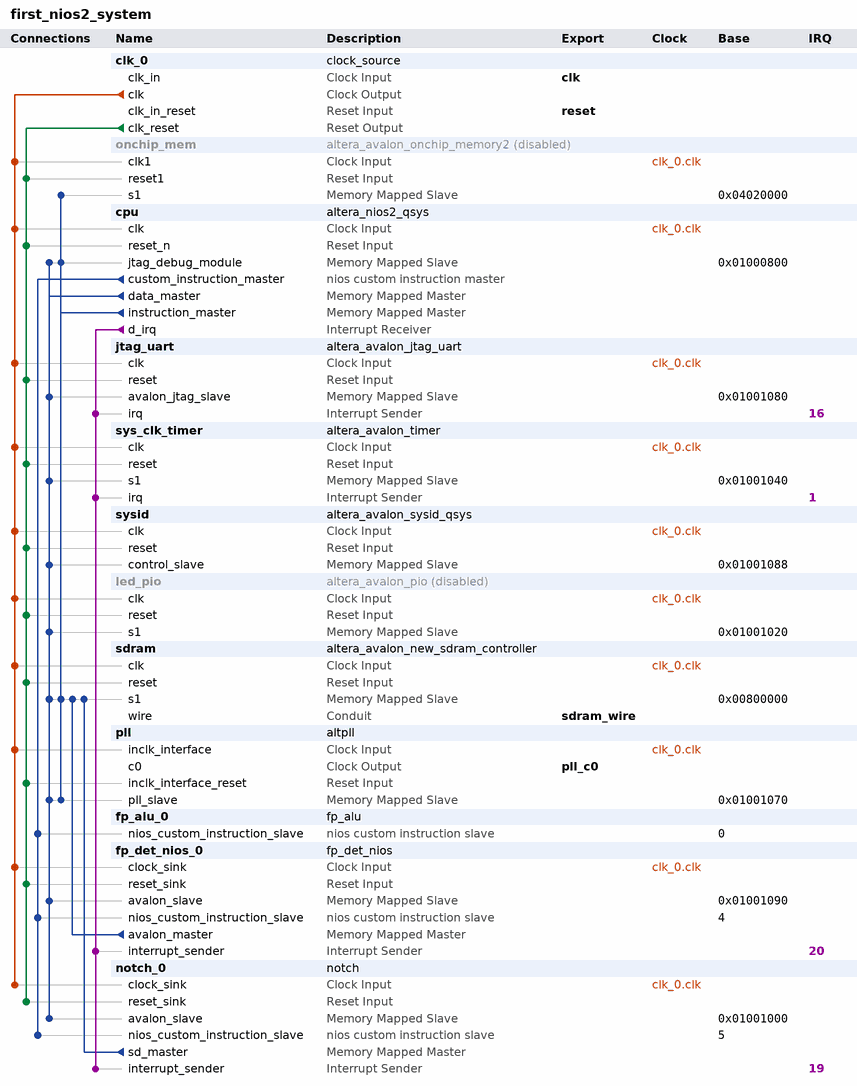
[diagram p0: system contents]
# Platform Designer (Qsys) system first_nios2_system, Cyclone III EP3C120F780C7
# Parameters at their usual value, and those the tool derives, are not listed.
package require -exact qsys 12.0
create_system first_nios2_system
set_project_property DEVICE_FAMILY {Cyclone III}
set_project_property DEVICE EP3C120F780C7

add_instance clk_0 clock_source 12.0
set_instance_parameter_value clk_0 clockFrequency 50000000

add_instance onchip_mem altera_avalon_onchip_memory2 12.0
set_instance_property onchip_mem ENABLED false
set_instance_parameter_value onchip_mem dataWidth 32
set_instance_parameter_value onchip_mem dualPort false
set_instance_parameter_value onchip_mem initMemContent true
set_instance_parameter_value onchip_mem initializationFileName onchip_mem
set_instance_parameter_value onchip_mem memorySize 102400

add_instance cpu altera_nios2_qsys 12.0
set_instance_parameter_value cpu muldiv_divider true
set_instance_parameter_value cpu resetSlave sdram.s1
set_instance_parameter_value cpu exceptionSlave sdram.s1
set_instance_parameter_value cpu breakSlave cpu.jtag_debug_module
set_instance_parameter_value cpu impl Small
set_instance_parameter_value cpu icache_size 2048

add_instance jtag_uart altera_avalon_jtag_uart 12.0
set_instance_parameter_value jtag_uart simInteractiveOptions INTERACTIVE_ASCII_OUTPUT

add_instance sys_clk_timer altera_avalon_timer 12.0
set_instance_parameter_value sys_clk_timer period 1
set_instance_parameter_value sys_clk_timer periodUnits MSEC
set_instance_parameter_value sys_clk_timer timerPreset FULL_FEATURED

add_instance sysid altera_avalon_sysid_qsys 12.0
set_instance_parameter_value sysid id 0

add_instance led_pio altera_avalon_pio 12.0
set_instance_property led_pio ENABLED false
set_instance_parameter_value led_pio direction Output
set_instance_parameter_value led_pio width 8

add_instance sdram altera_avalon_new_sdram_controller 12.0
set_instance_parameter_value sdram TAC 5.5
set_instance_parameter_value sdram TRCD 20.0
set_instance_parameter_value sdram TRP 20.0
set_instance_parameter_value sdram casLatency 3
set_instance_parameter_value sdram columnWidth 8
set_instance_parameter_value sdram dataWidth 16
set_instance_parameter_value sdram generateSimulationModel false
set_instance_parameter_value sdram model custom
set_instance_parameter_value sdram numberOfBanks 4
set_instance_parameter_value sdram numberOfChipSelects 1
set_instance_parameter_value sdram powerUpDelay 100.0
set_instance_parameter_value sdram refreshPeriod 15.625
set_instance_parameter_value sdram rowWidth 12

add_instance pll altpll 12.0
set_instance_parameter_value pll INCLK0_INPUT_FREQUENCY 20000
set_instance_parameter_value pll GATE_LOCK_SIGNAL NO
set_instance_parameter_value pll VALID_LOCK_MULTIPLIER 1
set_instance_parameter_value pll INVALID_LOCK_MULTIPLIER 5
set_instance_parameter_value pll CLK0_MULTIPLY_BY 1
set_instance_parameter_value pll CLK0_DIVIDE_BY 1
set_instance_parameter_value pll CLK0_PHASE_SHIFT -2550
set_instance_parameter_value pll PORT_clk1 PORT_UNUSED
set_instance_parameter_value pll PORT_clk2 PORT_UNUSED
set_instance_parameter_value pll PORT_clk3 PORT_UNUSED
set_instance_parameter_value pll PORT_ARESET PORT_UNUSED
set_instance_parameter_value pll PORT_LOCKED PORT_UNUSED

add_instance fp_alu_0 fp_alu 1.0
set_instance_parameter_value fp_alu_0 NaN 2147483647

add_instance fp_det_nios_0 fp_det_nios 1.0
set_instance_parameter_value fp_det_nios_0 DEFAULT_DIMENSION 10

add_instance notch_0 notch 1.0
set_instance_parameter_value notch_0 N 2
set_instance_parameter_value notch_0 NO_SAMPLES 963144
set_instance_parameter_value notch_0 SAMPLE_SCALING 2147483647
set_instance_parameter_value notch_0 COEFF_SCALING 16383
set_instance_parameter_value notch_0 DIVIDER_LATENCY 16
set_instance_parameter_value notch_0 SDRAM_WORD_SKIP 4

# connections
add_connection clk_0.clk cpu.clk clock
add_connection clk_0.clk fp_det_nios_0.clock_sink clock
add_connection clk_0.clk jtag_uart.clk clock
add_connection clk_0.clk led_pio.clk clock
add_connection clk_0.clk notch_0.clock_sink clock
add_connection clk_0.clk onchip_mem.clk1 clock
add_connection clk_0.clk pll.inclk_interface clock
add_connection clk_0.clk sdram.clk clock
add_connection clk_0.clk sys_clk_timer.clk clock
add_connection clk_0.clk sysid.clk clock
add_connection clk_0.clk_reset cpu.reset_n reset
add_connection clk_0.clk_reset fp_det_nios_0.reset_sink reset
add_connection clk_0.clk_reset jtag_uart.reset reset
add_connection clk_0.clk_reset led_pio.reset reset
add_connection clk_0.clk_reset notch_0.reset_sink reset
add_connection clk_0.clk_reset onchip_mem.reset1 reset
add_connection clk_0.clk_reset pll.inclk_interface_reset reset
add_connection clk_0.clk_reset sdram.reset reset
add_connection clk_0.clk_reset sys_clk_timer.reset reset
add_connection clk_0.clk_reset sysid.reset reset
add_connection cpu.data_master cpu.jtag_debug_module avalon
set_connection_parameter_value cpu.data_master/cpu.jtag_debug_module baseAddress 0x01000800
add_connection cpu.data_master fp_det_nios_0.avalon_slave avalon
set_connection_parameter_value cpu.data_master/fp_det_nios_0.avalon_slave baseAddress 0x01001090
add_connection cpu.data_master jtag_uart.avalon_jtag_slave avalon
set_connection_parameter_value cpu.data_master/jtag_uart.avalon_jtag_slave baseAddress 0x01001080
add_connection cpu.data_master led_pio.s1 avalon
set_connection_parameter_value cpu.data_master/led_pio.s1 baseAddress 0x01001020
add_connection cpu.data_master notch_0.avalon_slave avalon
set_connection_parameter_value cpu.data_master/notch_0.avalon_slave baseAddress 0x01001000
add_connection cpu.data_master pll.pll_slave avalon
set_connection_parameter_value cpu.data_master/pll.pll_slave baseAddress 0x01001070
add_connection cpu.data_master sdram.s1 avalon
set_connection_parameter_value cpu.data_master/sdram.s1 baseAddress 0x00800000
add_connection cpu.data_master sys_clk_timer.s1 avalon
set_connection_parameter_value cpu.data_master/sys_clk_timer.s1 baseAddress 0x01001040
add_connection cpu.data_master sysid.control_slave avalon
set_connection_parameter_value cpu.data_master/sysid.control_slave baseAddress 0x01001088
add_connection cpu.instruction_master cpu.jtag_debug_module avalon
set_connection_parameter_value cpu.instruction_master/cpu.jtag_debug_module baseAddress 0x01000800
add_connection cpu.instruction_master onchip_mem.s1 avalon
set_connection_parameter_value cpu.instruction_master/onchip_mem.s1 baseAddress 0x04020000
add_connection cpu.instruction_master pll.pll_slave avalon
set_connection_parameter_value cpu.instruction_master/pll.pll_slave baseAddress 0x01001070
add_connection cpu.instruction_master sdram.s1 avalon
set_connection_parameter_value cpu.instruction_master/sdram.s1 baseAddress 0x00800000
add_connection fp_det_nios_0.avalon_master sdram.s1 avalon
set_connection_parameter_value fp_det_nios_0.avalon_master/sdram.s1 baseAddress 0x00800000
add_connection notch_0.sd_master sdram.s1 avalon
set_connection_parameter_value notch_0.sd_master/sdram.s1 baseAddress 0x00800000
add_connection cpu.d_irq fp_det_nios_0.interrupt_sender interrupt
set_connection_parameter_value cpu.d_irq/fp_det_nios_0.interrupt_sender irqNumber 20
add_connection cpu.d_irq jtag_uart.irq interrupt
set_connection_parameter_value cpu.d_irq/jtag_uart.irq irqNumber 16
add_connection cpu.d_irq notch_0.interrupt_sender interrupt
set_connection_parameter_value cpu.d_irq/notch_0.interrupt_sender irqNumber 19
add_connection cpu.d_irq sys_clk_timer.irq interrupt
set_connection_parameter_value cpu.d_irq/sys_clk_timer.irq irqNumber 1
add_connection cpu.custom_instruction_master fp_alu_0.nios_custom_instruction_slave nios_custom_instruction
set_connection_parameter_value cpu.custom_instruction_master/fp_alu_0.nios_custom_instruction_slave CIName fp_alu_0
set_connection_parameter_value cpu.custom_instruction_master/fp_alu_0.nios_custom_instruction_slave baseAddress 0
add_connection cpu.custom_instruction_master fp_det_nios_0.nios_custom_instruction_slave nios_custom_instruction
set_connection_parameter_value cpu.custom_instruction_master/fp_det_nios_0.nios_custom_instruction_slave CIName fp_det_nios_0
set_connection_parameter_value cpu.custom_instruction_master/fp_det_nios_0.nios_custom_instruction_slave baseAddress 4
add_connection cpu.custom_instruction_master notch_0.nios_custom_instruction_slave nios_custom_instruction
set_connection_parameter_value cpu.custom_instruction_master/notch_0.nios_custom_instruction_slave CIName notch_0
set_connection_parameter_value cpu.custom_instruction_master/notch_0.nios_custom_instruction_slave baseAddress 5

# exported interfaces
add_interface clk clock sink
set_interface_property clk EXPORT_OF clk_0.clk_in
add_interface reset reset sink
set_interface_property reset EXPORT_OF clk_0.clk_in_reset
add_interface sdram_wire conduit end
set_interface_property sdram_wire EXPORT_OF sdram.wire
add_interface pll_c0 clock source
set_interface_property pll_c0 EXPORT_OF pll.c0

save_system first_nios2_system.qsys
